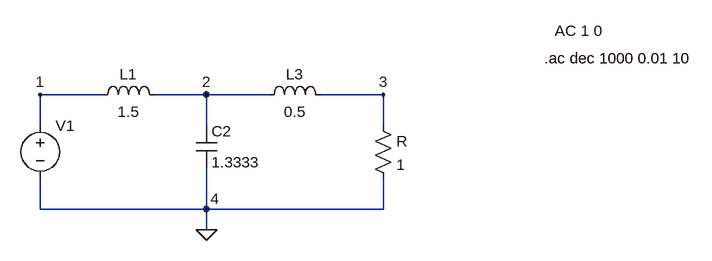
[diagram p0: schematic Circuito.asc]
Circuito.asc, the LTspice schematic file:
Version 4
SHEET 1 1004 680
WIRE 80 160 -16 160
WIRE 240 160 160 160
WIRE 336 160 240 160
WIRE 512 160 416 160
WIRE -16 208 -16 160
WIRE 240 208 240 160
WIRE 512 208 512 160
WIRE -16 336 -16 288
WIRE 240 336 240 272
WIRE 240 336 -16 336
WIRE 512 336 512 288
WIRE 512 336 240 336
WIRE 240 368 240 336
FLAG 240 368 0
FLAG -16 160 1
FLAG 240 160 2
FLAG 512 160 3
FLAG 240 336 4
SYMBOL ind 64 176 R270
WINDOW 0 32 56 VTop 2
WINDOW 3 5 56 VBottom 2
SYMATTR InstName L1
SYMATTR Value 1.5
SYMBOL ind 320 176 R270
WINDOW 0 32 56 VTop 2
WINDOW 3 5 56 VBottom 2
SYMATTR InstName L3
SYMATTR Value 0.5
SYMBOL cap 224 208 R0
SYMATTR InstName C2
SYMATTR Value 1.3333
SYMBOL res 496 192 R0
SYMATTR InstName R
SYMATTR Value 1
SYMBOL voltage -16 192 R0
WINDOW 123 792 -130 Left 2
WINDOW 39 0 0 Left 0
SYMATTR InstName V1
SYMATTR Value ""
SYMATTR Value2 AC 1 0
TEXT 760 104 Left 2 !.ac dec 1000 0.01 10

The netlist it stands for:
* Circuito.asc
L1 1 2 1.5
L3 2 3 0.5
C2 2 0 1.3333
R 3 0 1
V1 1 0 AC 1 0
.ac dec 1000 0.01 10
.backanno
.end